# Altium project LPCB221__RLOOP__GIMBAL_NODE.PrjPCB
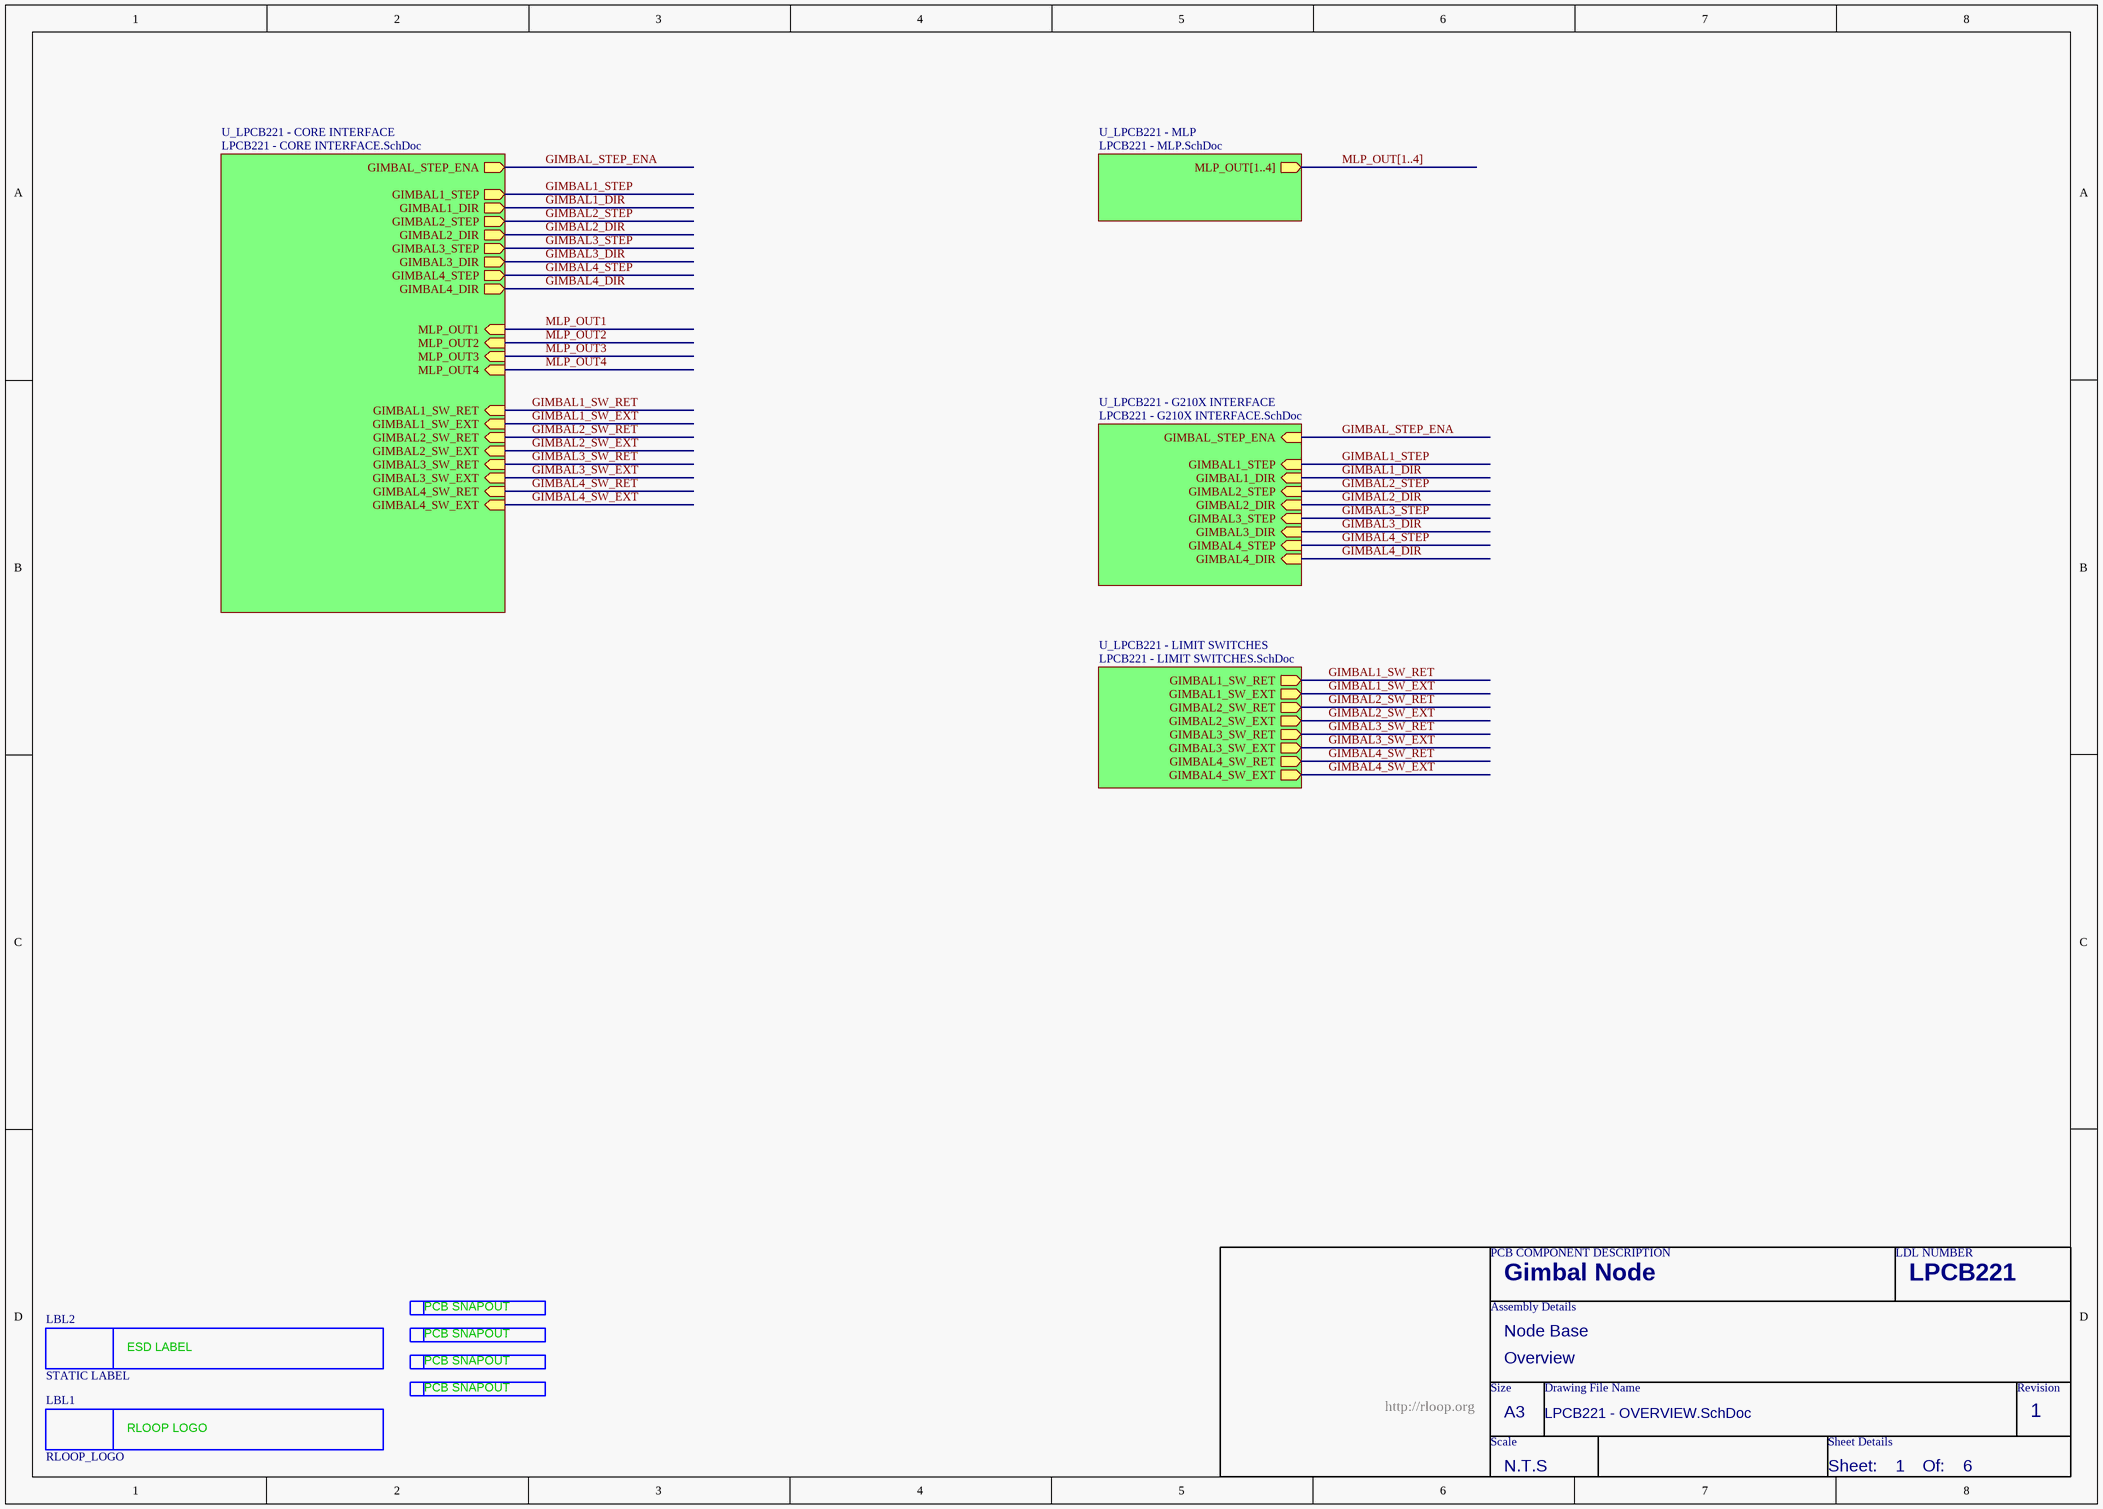
[diagram p0: LPCB221 - OVERVIEW.SchDoc]
6 sheets, 87 parts. Net scope: hierarchical (ports join the sheet entries above them; power ports are global).
Board files: LPCB221R0.PcbDoc, LPCB221R0__ASCII.PcbDoc
Sheets:
  LPCB221 - OVERVIEW.SchDoc
    U_LPCB221 - G210X INTERFACE = LPCB221 - G210X INTERFACE.SchDoc
    U_LPCB221 - MLP = LPCB221 - MLP.SchDoc
      M1 = LPCB221 - MLP CHANNEL.SchDoc
      M2 = LPCB221 - MLP CHANNEL.SchDoc
      M3 = LPCB221 - MLP CHANNEL.SchDoc
      M4 = LPCB221 - MLP CHANNEL.SchDoc
    U_LPCB221 - LIMIT SWITCHES = LPCB221 - LIMIT SWITCHES.SchDoc
    U_LPCB221 - CORE INTERFACE = LPCB221 - CORE INTERFACE.SchDoc

## Sheet LPCB221 - OVERVIEW.SchDoc
size A3; Address1: Factory 10; Address2: 9-13 Dingley Avenue, Dandeong, VICTORIA 3175, AUSTRALIA; DocumentNumber: 1; Revision: 1; SheetNumber: 1; SheetTotal: 6; Lockie__PCB_SUB_ASSEMBLY: Overview; Lockie__PCB_ASSEMBLY: Node Base; Lockie__LDL: LPCB221; Lockie__PCB_DESCRIPTION: Gimbal Node

### Parts
LBL1  RLOOP_LOGO  [RLOOP_LOGO]  (no BOM)
LBL2  STATIC LABEL  [STATIC_LABEL]  (no BOM)
SN1  PCB_SNAPOUT  [SNAPOUT_NEW]  (value not drawn)  (no BOM)
SN2  PCB_SNAPOUT  [SNAPOUT_NEW]  (value not drawn)  (no BOM)
SN3  PCB_SNAPOUT  [SNAPOUT_NEW]  (value not drawn)  (no BOM)
SN4  PCB_SNAPOUT  [SNAPOUT_NEW]  (value not drawn)  (no BOM)

### Sub-sheets
U_LPCB221 - CORE INTERFACE = LPCB221 - CORE INTERFACE.SchDoc: GIMBAL_STEP_ENA (out), GIMBAL2_DIR (out), GIMBAL1_STEP (out), GIMBAL2_STEP (out), GIMBAL1_DIR (out), GIMBAL4_DIR (out), GIMBAL3_STEP (out), GIMBAL4_STEP (out), GIMBAL3_DIR (out), MLP_OUT1 (in), MLP_OUT2 (in), MLP_OUT3 (in), MLP_OUT4 (in), GIMBAL1_SW_RET (in), GIMBAL1_SW_EXT (in), GIMBAL2_SW_RET (in), GIMBAL2_SW_EXT (in), GIMBAL3_SW_RET (in), GIMBAL3_SW_EXT (in), GIMBAL4_SW_RET (in), GIMBAL4_SW_EXT (in)
U_LPCB221 - G210X INTERFACE = LPCB221 - G210X INTERFACE.SchDoc: GIMBAL_STEP_ENA (in), GIMBAL2_DIR (in), GIMBAL1_STEP (in), GIMBAL2_STEP (in), GIMBAL1_DIR (in), GIMBAL4_DIR (in), GIMBAL3_STEP (in), GIMBAL4_STEP (in), GIMBAL3_DIR (in)
U_LPCB221 - LIMIT SWITCHES = LPCB221 - LIMIT SWITCHES.SchDoc: GIMBAL1_SW_RET (out), GIMBAL1_SW_EXT (out), GIMBAL2_SW_RET (out), GIMBAL2_SW_EXT (out), GIMBAL3_SW_RET (out), GIMBAL3_SW_EXT (out), GIMBAL4_SW_RET (out), GIMBAL4_SW_EXT (out)
U_LPCB221 - MLP = LPCB221 - MLP.SchDoc: MLP_OUT[1..4] (out)

### Nets
GIMBAL1_DIR: sheet U_LPCB221 - G210X INTERFACE/GIMBAL1_DIR, sheet U_LPCB221 - CORE INTERFACE/GIMBAL1_DIR
GIMBAL1_STEP: sheet U_LPCB221 - G210X INTERFACE/GIMBAL1_STEP, sheet U_LPCB221 - CORE INTERFACE/GIMBAL1_STEP
GIMBAL1_SW_EXT: sheet U_LPCB221 - LIMIT SWITCHES/GIMBAL1_SW_EXT, sheet U_LPCB221 - CORE INTERFACE/GIMBAL1_SW_EXT
GIMBAL1_SW_RET: sheet U_LPCB221 - LIMIT SWITCHES/GIMBAL1_SW_RET, sheet U_LPCB221 - CORE INTERFACE/GIMBAL1_SW_RET
GIMBAL2_DIR: sheet U_LPCB221 - G210X INTERFACE/GIMBAL2_DIR, sheet U_LPCB221 - CORE INTERFACE/GIMBAL2_DIR
GIMBAL2_STEP: sheet U_LPCB221 - G210X INTERFACE/GIMBAL2_STEP, sheet U_LPCB221 - CORE INTERFACE/GIMBAL2_STEP
GIMBAL2_SW_EXT: sheet U_LPCB221 - LIMIT SWITCHES/GIMBAL2_SW_EXT, sheet U_LPCB221 - CORE INTERFACE/GIMBAL2_SW_EXT
GIMBAL2_SW_RET: sheet U_LPCB221 - LIMIT SWITCHES/GIMBAL2_SW_RET, sheet U_LPCB221 - CORE INTERFACE/GIMBAL2_SW_RET
GIMBAL3_DIR: sheet U_LPCB221 - G210X INTERFACE/GIMBAL3_DIR, sheet U_LPCB221 - CORE INTERFACE/GIMBAL3_DIR
GIMBAL3_STEP: sheet U_LPCB221 - G210X INTERFACE/GIMBAL3_STEP, sheet U_LPCB221 - CORE INTERFACE/GIMBAL3_STEP
GIMBAL3_SW_EXT: sheet U_LPCB221 - LIMIT SWITCHES/GIMBAL3_SW_EXT, sheet U_LPCB221 - CORE INTERFACE/GIMBAL3_SW_EXT
GIMBAL3_SW_RET: sheet U_LPCB221 - LIMIT SWITCHES/GIMBAL3_SW_RET, sheet U_LPCB221 - CORE INTERFACE/GIMBAL3_SW_RET
GIMBAL4_DIR: sheet U_LPCB221 - G210X INTERFACE/GIMBAL4_DIR, sheet U_LPCB221 - CORE INTERFACE/GIMBAL4_DIR
GIMBAL4_STEP: sheet U_LPCB221 - G210X INTERFACE/GIMBAL4_STEP, sheet U_LPCB221 - CORE INTERFACE/GIMBAL4_STEP
GIMBAL4_SW_EXT: sheet U_LPCB221 - LIMIT SWITCHES/GIMBAL4_SW_EXT, sheet U_LPCB221 - CORE INTERFACE/GIMBAL4_SW_EXT
GIMBAL4_SW_RET: sheet U_LPCB221 - LIMIT SWITCHES/GIMBAL4_SW_RET, sheet U_LPCB221 - CORE INTERFACE/GIMBAL4_SW_RET
GIMBAL_STEP_ENA: sheet U_LPCB221 - G210X INTERFACE/GIMBAL_STEP_ENA, sheet U_LPCB221 - CORE INTERFACE/GIMBAL_STEP_ENA

### Buses and harness runs
bus MLP_OUT[1..4] = sheet U_LPCB221 - MLP/MLP_OUT[1..4]

### Notes on the sheet
- PCB COMPONENT DESCRIPTION
- LDL NUMBER
- Assembly Details
- Size
- Drawing File Name
- Revision
- http://rloop.org
- Scale
- A3
- Sheet Details
- N.T.S
- Sheet:
- Of:
- (in symbol PCB_SNAPOUT) PCB SNAPOUT
- (in symbol RLOOP_LOGO) RLOOP LOGO
- (in symbol STATIC LABEL) ESD LABEL

### Library data of the parts
LBL1 = RLOOP_LOGO: FMEDA__CHANNEL: DIAG; FMEDA__FUNCTION_IN_SYSTEM: *
LBL2 = STATIC LABEL: FMEDA__CHANNEL: DIAG; FMEDA__FUNCTION_IN_SYSTEM: *
SN1-SN4 = PCB_SNAPOUT: FMEDA__CHANNEL: DIAG; FMEDA__FUNCTION_IN_SYSTEM: *

## Sheet LPCB221 - G210X INTERFACE.SchDoc
size A3; Address1: Factory 10; Address2: 9-13 Dingley Avenue, Dandeong, VICTORIA 3175, AUSTRALIA; DocumentNumber: 3; Revision: 1; SheetNumber: 3; SheetTotal: 6; Lockie__PCB_SUB_ASSEMBLY: G210X Interface; Lockie__PCB_ASSEMBLY: Node Base; Lockie__LDL: LPCB221; Lockie__PCB_DESCRIPTION: Gimbal Node
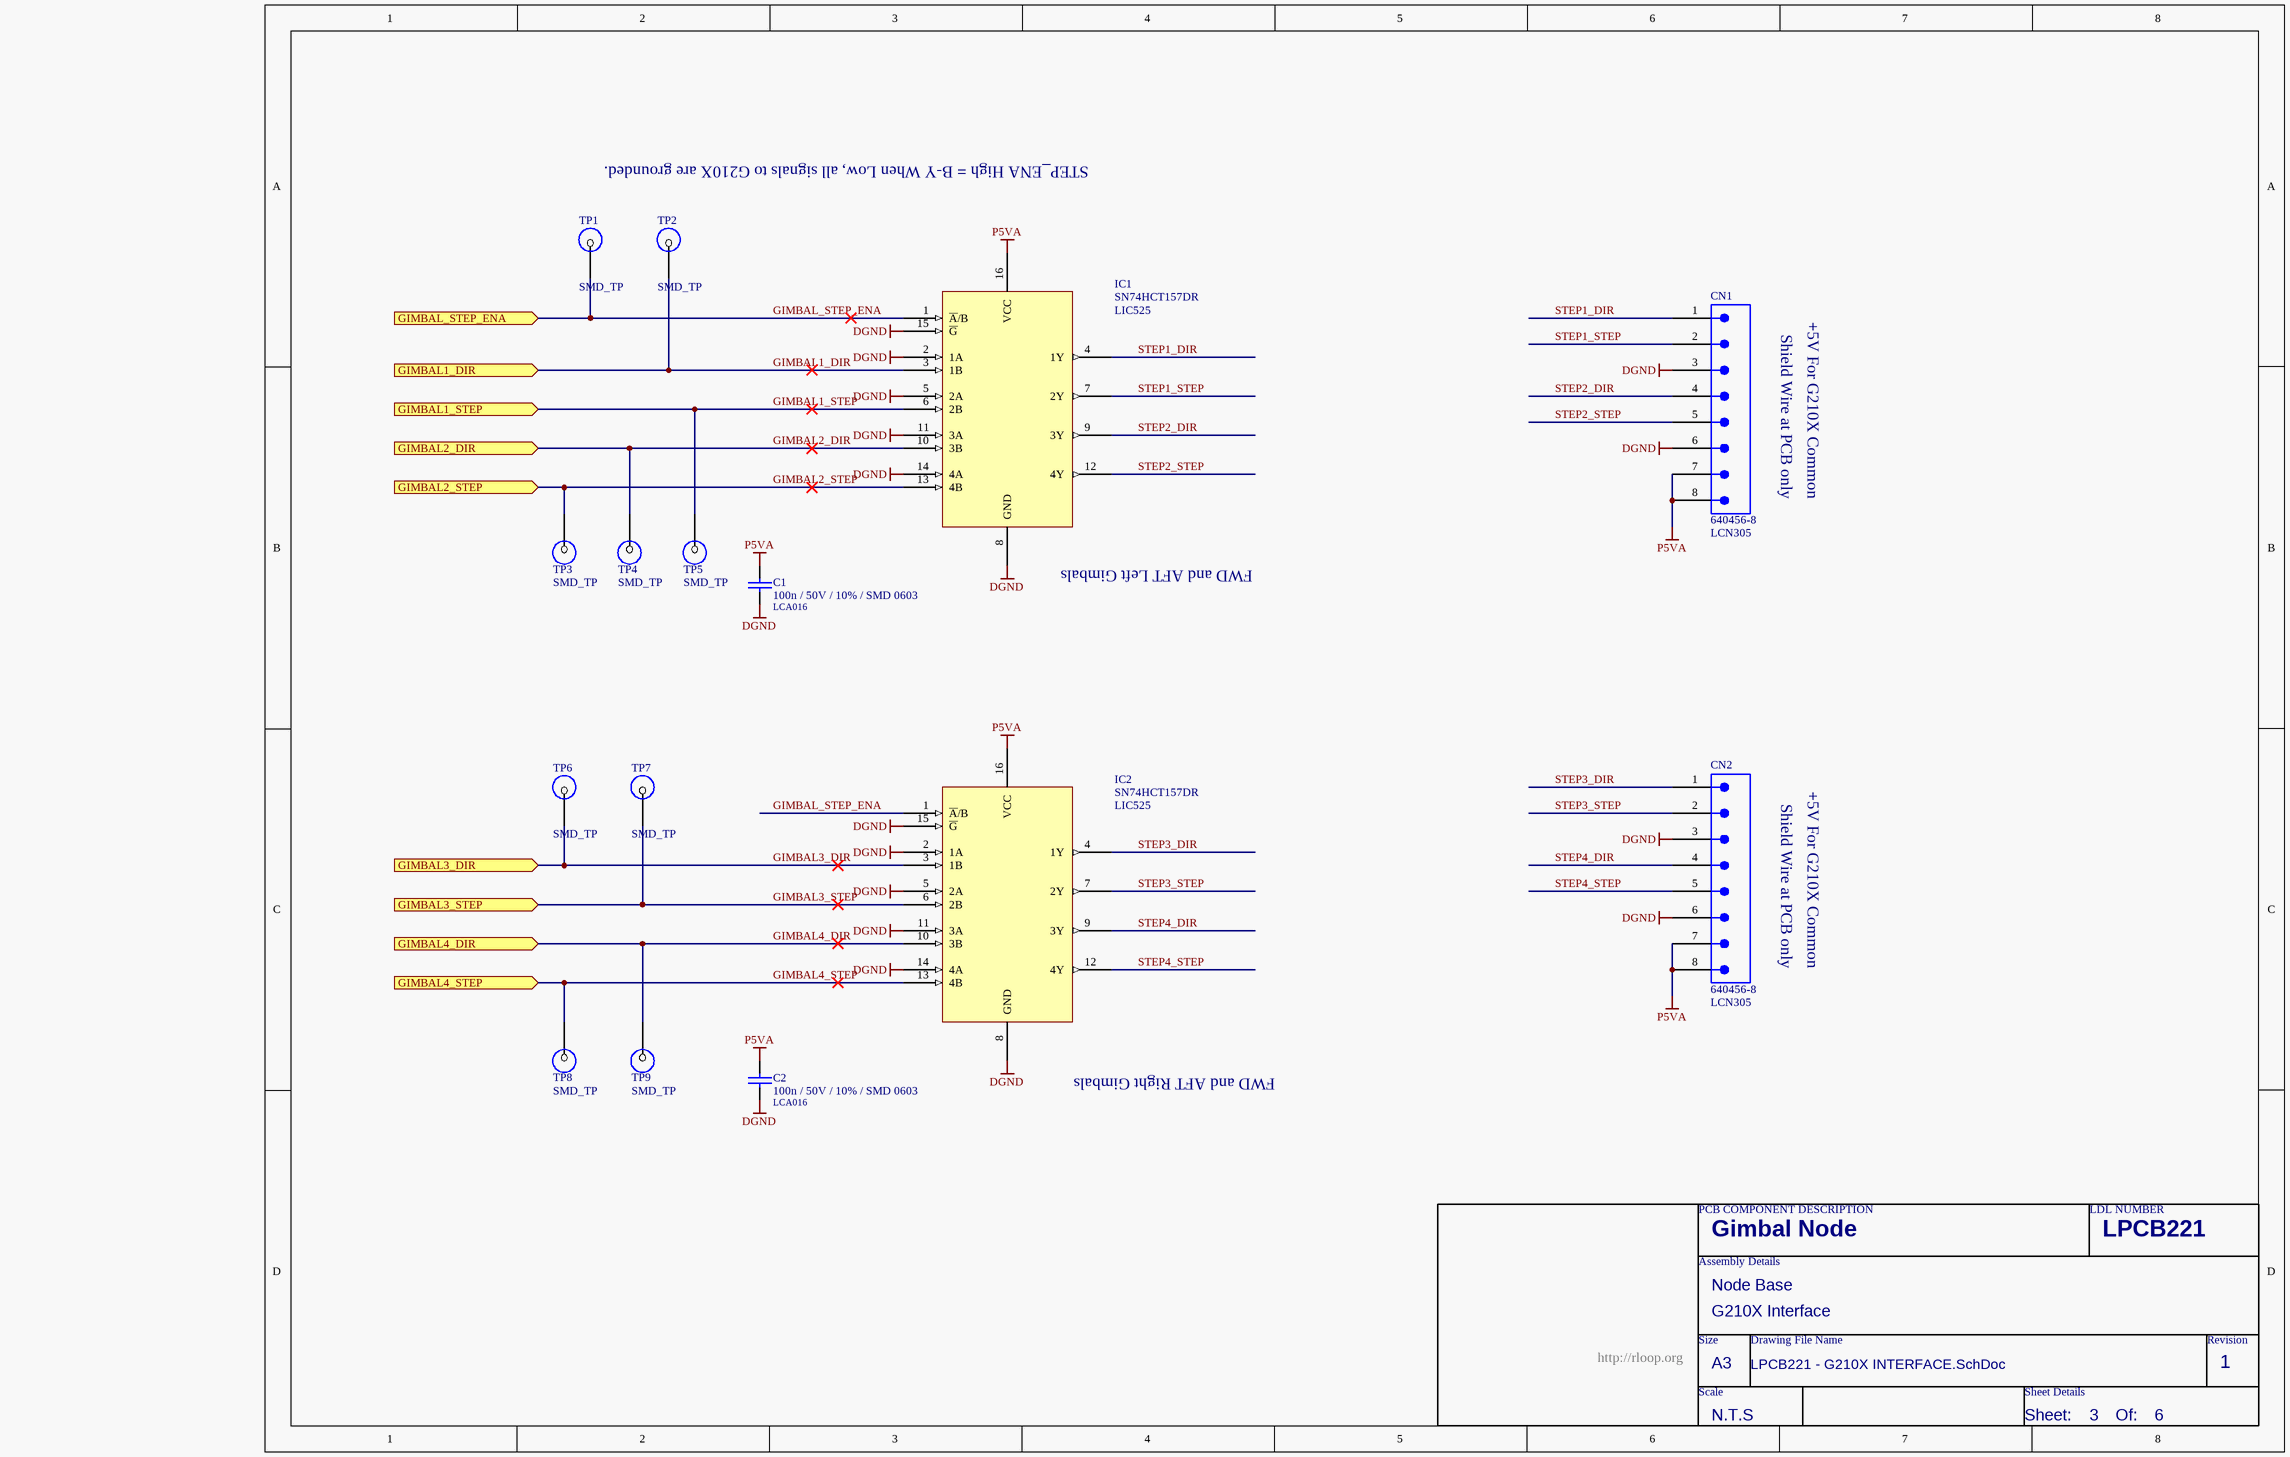
[diagram p1: LPCB221 - G210X INTERFACE.SchDoc]

### Parts
C1  100n / 50V / 10% / SMD 0603  LDL_NUMBER: LCA016  [LFP011__CC1608-0603-IPC7351_B]
C2  100n / 50V / 10% / SMD 0603  LDL_NUMBER: LCA016  [LFP011__CC1608-0603-IPC7351_B]
CN1  640456-8  LDL_NUMBER: LCN305  [640456-8]
CN2  640456-8  LDL_NUMBER: LCN305  [640456-8]
IC1  SN74HCT157DR  LDL_NUMBER: LIC525  [LFP079__SOP16]
IC2  SN74HCT157DR  LDL_NUMBER: LIC525  [LFP079__SOP16]
TP1  SMD_TP  [SMD-TP]  (no BOM)
TP2  SMD_TP  [SMD-TP]  (no BOM)
TP3  SMD_TP  [SMD-TP]  (no BOM)
TP4  SMD_TP  [SMD-TP]  (no BOM)
TP5  SMD_TP  [SMD-TP]  (no BOM)
TP6  SMD_TP  [SMD-TP]  (no BOM)
TP7  SMD_TP  [SMD-TP]  (no BOM)
TP8  SMD_TP  [SMD-TP]  (no BOM)
TP9  SMD_TP  [SMD-TP]  (no BOM)

### Ports
GIMBAL1_DIR (in), GIMBAL1_STEP (in), GIMBAL2_DIR (in), GIMBAL2_STEP (in), GIMBAL3_DIR (in), GIMBAL3_STEP (in), GIMBAL4_DIR (in), GIMBAL4_STEP (in), GIMBAL_STEP_ENA (in)

### Nets
DGND: C1.2 C2.2 CN1.3 CN1.6 CN2.3 CN2.6 IC1.2(1A) IC1.5(2A) IC1.8(GND) IC1.11(3A) IC1.14(4A) IC1.15(~{G}) IC2.2(1A) IC2.5(2A) IC2.8(GND) IC2.11(3A) IC2.14(4A) IC2.15(~{G})
P5VA: C1.1 C2.1 CN1.7 CN1.8 CN2.7 CN2.8 IC1.16(VCC) IC2.16(VCC)
GIMBAL1_DIR: IC1.3(1B) TP2.1 ; port GIMBAL1_DIR
GIMBAL1_STEP: IC1.6(2B) TP5.1 ; port GIMBAL1_STEP
GIMBAL2_DIR: IC1.10(3B) TP4.1 ; port GIMBAL2_DIR
GIMBAL2_STEP: IC1.13(4B) TP3.1 ; port GIMBAL2_STEP
GIMBAL3_DIR: IC2.3(1B) TP6.1 ; port GIMBAL3_DIR
GIMBAL3_STEP: IC2.6(2B) TP7.1 ; port GIMBAL3_STEP
GIMBAL4_DIR: IC2.10(3B) TP9.1 ; port GIMBAL4_DIR
GIMBAL4_STEP: IC2.13(4B) TP8.1 ; port GIMBAL4_STEP
GIMBAL_STEP_ENA: IC1.1(~{A}/B) IC2.1(~{A}/B) TP1.1 ; port GIMBAL_STEP_ENA
STEP1_DIR: CN1.1 IC1.4(1Y)
STEP1_STEP: CN1.2 IC1.7(2Y)
STEP2_DIR: CN1.4 IC1.9(3Y)
STEP2_STEP: CN1.5 IC1.12(4Y)
STEP3_DIR: CN2.1 IC2.4(1Y)
STEP3_STEP: CN2.2 IC2.7(2Y)
STEP4_DIR: CN2.4 IC2.9(3Y)
STEP4_STEP: CN2.5 IC2.12(4Y)

### Notes on the sheet
- STEP_ENA High = B-Y When Low, all signals to G210X are grounded.
- Shield Wire at PCB only
- +5V For G210X Common
- (near IC1) FWD and AFT Left Gimbals
- FWD and AFT Right Gimbals
- PCB COMPONENT DESCRIPTION
- LDL NUMBER
- Assembly Details
- Size
- Drawing File Name
- Revision
- http://rloop.org
- Scale
- A3
- Sheet Details
- N.T.S
- Sheet:
- Of:

### Library data of the parts
C1 C2 = 100n / 50V / 10% / SMD 0603: Capacitor, Ceramic Chip, 100nF (0.1uF), 50V, 5%, SMD 0603 [LCA016]; FMEDA__OPERATING__VOLTAGE_MIN: 0; FMEDA__OPERATING__VOLTAGE_MAX: 3.3; FMEDA__OPERATING__TEMP_MIN: -20; FMEDA__OPERATING__TEMP_TYP: 27; FMEDA__OPERATING__TEMP_MAX: 50; FMEDA__CHANNEL: COM; Value: 100n; FMEDA__FUNCTION_IN_SYSTEM: *; FMEDA__OPERATING__VOLTAGE_TYP: 3.3
CN1 CN2 = 640456-8: Connector, Male Header, 8 Way; FMEDA__CHANNEL: COM; FMEDA__OPERATING__CURRENT_MAX: 0; FMEDA__OPERATING__TEMP_MAX: 50; FMEDA__OPERATING__TEMP_MIN: -20; FMEDA__OPERATING__TEMP_TYP: 27; FMEDA__OPERATING__VOLTAGE_MAX: 16; FMEDA__OPERATING__VOLTAGE_TYP: 12; FMEDA__FUNCTION_IN_SYSTEM: *; FMEDA__OPERATING__CURRENT_MIN: 0; FMEDA__OPERATING__CURRENT_TYP: 0; FMEDA__OPERATING__VOLTAGE_MIN: 0
IC1 IC2 = SN74HCT157DR: IC, Multiplexer Select 2-1 [LIC525]; FMEDA__CHANNEL: COM; FMEDA__FUNCTION_IN_SYSTEM: *
TP1-TP9 = SMD_TP: SMD Test Point; FMEDA__CHANNEL: COM; FMEDA__OPERATING__CURRENT_MAX: 0; FMEDA__OPERATING__TEMP_MAX: 50; FMEDA__OPERATING__TEMP_MIN: -20; FMEDA__OPERATING__TEMP_TYP: 27; FMEDA__OPERATING__VOLTAGE_MAX: 16; FMEDA__OPERATING__VOLTAGE_TYP: 12; FMEDA__OPERATING__CURRENT_MIN: 0; FMEDA__OPERATING__CURRENT_TYP: 0; FMEDA__OPERATING__VOLTAGE_MIN: 0

## Sheet LPCB221 - MLP.SchDoc
size A3; Address1: Factory 10; Address2: 9-13 Dingley Avenue, Dandeong, VICTORIA 3175, AUSTRALIA; DocumentNumber: 5; Revision: 1; SheetNumber: 5; SheetTotal: 6; Lockie__PCB_SUB_ASSEMBLY: MLP Interface; Lockie__PCB_ASSEMBLY: Node Base; Lockie__LDL: LPCB221; Lockie__PCB_DESCRIPTION: Gimbal Node
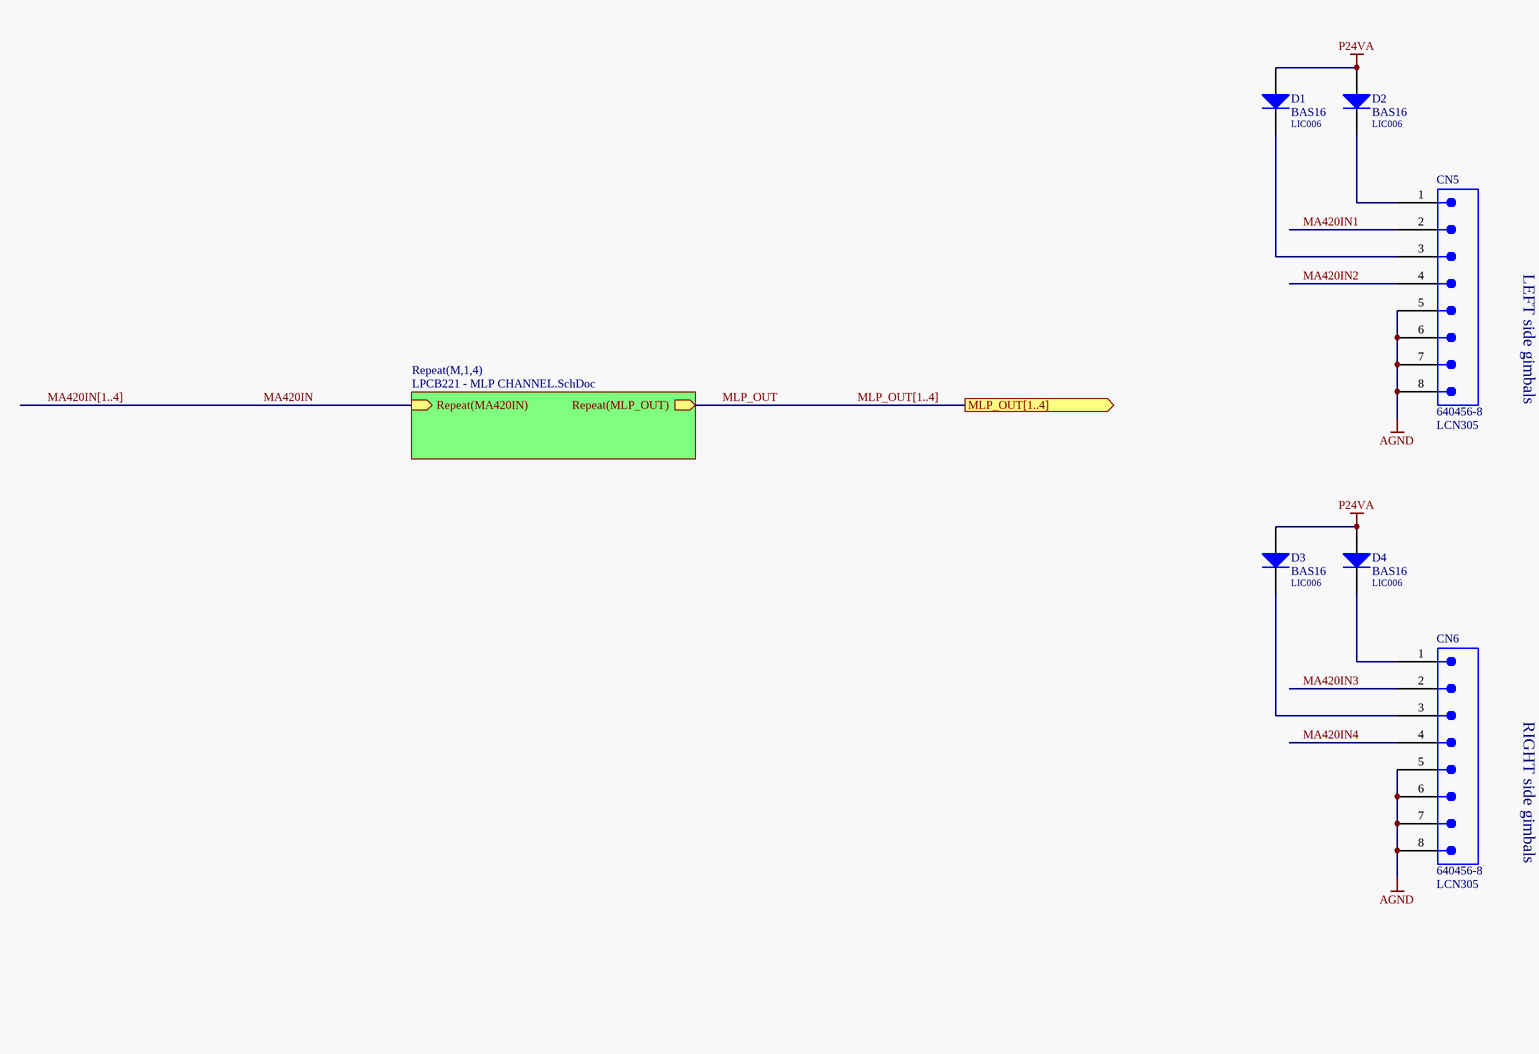
[diagram p2: LPCB221 - MLP.SchDoc]

### Parts
CN5  640456-8  LDL_NUMBER: LCN305  [640456-8]
CN6  640456-8  LDL_NUMBER: LCN305  [640456-8]
D1  BAS16  LDL_NUMBER: LIC006  [LFP021__SOT23]
D2  BAS16  LDL_NUMBER: LIC006  [LFP021__SOT23]
D3  BAS16  LDL_NUMBER: LIC006  [LFP021__SOT23]
D4  BAS16  LDL_NUMBER: LIC006  [LFP021__SOT23]

### Sub-sheets
Repeat(M,1,4) = LPCB221 - MLP CHANNEL.SchDoc: Repeat(MA420IN) (in), Repeat(MLP_OUT) (out)

### Ports
MLP_OUT[1..4] (out)

### Nets
AGND: CN5.5 CN5.6 CN5.7 CN5.8 CN6.5 CN6.6 CN6.7 CN6.8
P24VA: D1.1(A) D2.1(A) D3.1(A) D4.1(A)
MA420IN: sheet Repeat(M,1,4)/Repeat(MA420IN)
MA420IN1: CN5.2
MA420IN2: CN5.4
MA420IN3: CN6.2
MA420IN4: CN6.4
MLP_OUT: sheet Repeat(M,1,4)/Repeat(MLP_OUT)
NetCN5_1: CN5.1 D2.3(K)
NetCN5_3: CN5.3 D1.3(K)
NetCN6_1: CN6.1 D4.3(K)
NetCN6_3: CN6.3 D3.3(K)

### Buses and harness runs
bus MA420IN[1..4]
bus MLP_OUT[1..4] = port MLP_OUT[1..4]

### Notes on the sheet
- LEFT side gimbals
- RIGHT side gimbals
- PCB COMPONENT DESCRIPTION
- LDL NUMBER
- Assembly Details
- Size
- Drawing File Name
- Revision
- http://rloop.org
- Scale
- A3
- Sheet Details
- N.T.S
- Sheet:
- Of:

### Library data of the parts
CN5 CN6 = 640456-8: as CN1 on sheet LPCB221 - G210X INTERFACE; FMEDA__FUNCTION_IN_SYSTEM: *; FMEDA__OPERATING__CURRENT_MIN: 0; FMEDA__OPERATING__CURRENT_TYP: 0; FMEDA__OPERATING__VOLTAGE_MIN: 0
D1-D4 = BAS16: Diode, Small Signal, 0.2A, 85V, SMD SOT-23 [LIC006]; FMEDA__OPERATING__CURRENT_MIN: 0; FMEDA__OPERATING__TEMP_MIN: -20; FMEDA__OPERATING__TEMP_TYP: 27; FMEDA__OPERATING__TEMP_MAX: 50; FMEDA__CHANNEL: COM; FMEDA__OPERATING__CURRENT_MAX: 0; FMEDA__OPERATING__VOLTAGE_MIN: 0; FMEDA__OPERATING__VOLTAGE_MAX: 0; FMEDA__FUNCTION_IN_SYSTEM: *; FMEDA__OPERATING__CURRENT_TYP: 0; FMEDA__OPERATING__VOLTAGE_TYP: 0

## Sheet LPCB221 - MLP CHANNEL.SchDoc
size A3; Address1: Factory 10; Address2: 9-13 Dingley Avenue, Dandeong, VICTORIA 3175, AUSTRALIA; DocumentNumber: 6; Revision: 1; SheetNumber: 6; SheetTotal: 6; Lockie__PCB_SUB_ASSEMBLY: MLP Multichannel; Lockie__PCB_ASSEMBLY: Node Base; Lockie__LDL: LPCB221; Lockie__PCB_DESCRIPTION: Gimbal Node
Used 4 times, as channels U_LPCB221 - MLP/M1, U_LPCB221 - MLP/M2, U_LPCB221 - MLP/M3, U_LPCB221 - MLP/M4. Parts and nets are listed once, with the designators drawn on the sheet.
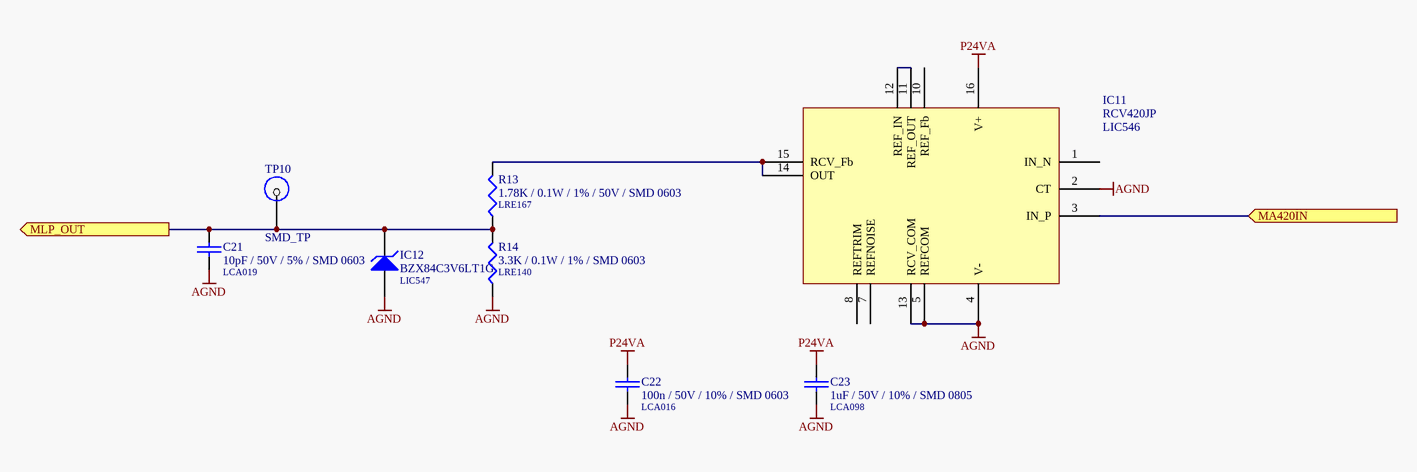
[diagram p3: LPCB221 - MLP CHANNEL.SchDoc]

### Parts
C21  10pF / 50V / 5% / SMD 0603  LDL_NUMBER: LCA019  [LFP011__CC1608-0603-IPC7351_B]
C22  100n / 50V / 10% / SMD 0603  LDL_NUMBER: LCA016  [LFP011__CC1608-0603-IPC7351_B]
C23  1uF / 50V / 10% / SMD 0805  LDL_NUMBER: LCA098  [LFP010__CC2012-0805-IPC7351_B]
IC11  RCV420JP  LDL_NUMBER: LIC546  [DIP-P16/X1.5]
IC12  BZX84C3V6LT1G  LDL_NUMBER: LIC547  [LFP021__SOT23]
R13  1.78K / 0.1W / 1% / 50V / SMD 0603  LDL_NUMBER: LRE167  [LFP020__CR1608-0603-IPC7351_B]
R14  3.3K / 0.1W / 1% / SMD 0603  LDL_NUMBER: LRE140  [LFP020__CR1608-0603-IPC7351_B]
TP10  SMD_TP  [SMD-TP]  (no BOM)

### Ports
MA420IN (in), MLP_OUT (out)

### Nets
AGND: C21.2 C22.2 C23.2 IC11.2(CT) IC11.4(V-) IC11.5(REFCOM) IC11.13(RCV_COM) IC12.1(A) R14.1
P24VA: C22.1 C23.1 IC11.16(V+)
MA420IN: IC11.3(IN_P) ; port MA420IN
MLP_OUT: C21.1 IC12.3(K) R13.1 R14.2 TP10.1 ; port MLP_OUT
NetIC11_11: IC11.11(REF_OUT) IC11.12(REF_IN)
NetIC11_14: IC11.14(OUT) IC11.15(RCV_Fb) R13.2

Not connected (* = marked no-connect by the designer): IC11 1(IN_N) 7(REFNOISE) 8(REFTRIM) 10(REF_Fb)

### Channels
U_LPCB221 - MLP/M1: designators end in _M1; ports MA420IN=MA420IN1 MLP_OUT=MLP_OUT1
U_LPCB221 - MLP/M2: designators end in _M2; ports MA420IN=MA420IN2 MLP_OUT=MLP_OUT2
U_LPCB221 - MLP/M3: designators end in _M3; ports MA420IN=MA420IN3 MLP_OUT=MLP_OUT3
U_LPCB221 - MLP/M4: designators end in _M4; ports MA420IN=MA420IN4 MLP_OUT=MLP_OUT4

### Notes on the sheet
- PCB COMPONENT DESCRIPTION
- LDL NUMBER
- Assembly Details
- Size
- Drawing File Name
- Revision
- http://rloop.org
- Scale
- A3
- Sheet Details
- N.T.S
- Sheet:
- Of:

### Library data of the parts
C21 = 10pF / 50V / 5% / SMD 0603: Capacitor, Ceramic Chip, 10pF, 50V, 5%, SMD 0603 [LCA019]; Value: 10p; FMEDA__OPERATING__VOLTAGE_MAX: 3.3; FMEDA__OPERATING__VOLTAGE_MIN: 0; FMEDA__OPERATING__TEMP_MAX: 50; FMEDA__OPERATING__TEMP_MIN: -20; FMEDA__OPERATING__TEMP_TYP: 27; FMEDA__CHANNEL: COM; FMEDA__OPERATING__VOLTAGE_TYP: 3.3; FMEDA__FUNCTION_IN_SYSTEM: *
C22 = 100n / 50V / 10% / SMD 0603: as C1 on sheet LPCB221 - G210X INTERFACE; Value: 100n; FMEDA__FUNCTION_IN_SYSTEM: *; FMEDA__OPERATING__VOLTAGE_TYP: 3.3
C23 = 1uF / 50V / 10% / SMD 0805: Capacitor, Ceramic Chip, 1uF, 50V, SMD 0805 [LCA098]; Value: 1u; FMEDA__OPERATING__VOLTAGE_MAX: 3.3; FMEDA__OPERATING__VOLTAGE_MIN: 0; FMEDA__OPERATING__TEMP_MAX: 50; FMEDA__OPERATING__TEMP_MIN: -20; FMEDA__OPERATING__TEMP_TYP: 27; FMEDA__CHANNEL: COM; FMEDA__OPERATING__VOLTAGE_TYP: 3.3; FMEDA__FUNCTION_IN_SYSTEM: *
IC11 = RCV420JP: IC, 4-20mA Interface, DIP16 [LIC546]
IC12 = BZX84C3V6LT1G: Diode, Zener, 3.6V, 0.225W, SMD [LIC083]; FMEDA__OPERATING__TEMP_MAX: 50; FMEDA__OPERATING__TEMP_MIN: -20; FMEDA__OPERATING__TEMP_TYP: 27; FMEDA__OPERATING__VOLTAGE_MAX: 0; FMEDA__CHANNEL: COM; Revision: 17-Jul-2002: Re-released for DXP Platform.; FMEDA__FUNCTION_IN_SYSTEM: *; FMEDA__OPERATING__VOLTAGE_MIN: 0; FMEDA__OPERATING__VOLTAGE_TYP: 0; FMEDA__OPERATING__CURRENT_MAX: 0; FMEDA__OPERATING__CURRENT_MIN: 0; FMEDA__OPERATING__CURRENT_TYP: 0
R13 = 1.78K / 0.1W / 1% / 50V / SMD 0603: Resistor, Ceramic Chip, 1.78K, 0.1W, 1%, SMD 0603 [LRE167]; FMEDA__OPERATING__POWER_MAX: 0.01; FMEDA__OPERATING__POWER_MIN: 0; FMEDA__OPERATING__TEMP_MAX: 50; FMEDA__OPERATING__TEMP_MIN: -20; FMEDA__OPERATING__TEMP_TYP: 27; FMEDA__CHANNEL: COM; Value: 1.78K; FMEDA__OPERATING__VOLTAGE_MAX: 0; FMEDA__OPERATING__VOLTAGE_MIN: 0; FMEDA__OPERATING__VOLTAGE_TYP: 0; FMEDA__FUNCTION_IN_SYSTEM: *
R14 = 3.3K / 0.1W / 1% / SMD 0603: Resistor, Ceramic Chip, 3.3K0, 0.1W, 1%, SMD 0603 [LRE140]; FMEDA__OPERATING__POWER_MAX: 0; FMEDA__OPERATING__TEMP_MAX: 50; FMEDA__OPERATING__TEMP_MIN: -20; FMEDA__OPERATING__TEMP_TYP: 27; FMEDA__CHANNEL: COM; Value: 3.3K; FMEDA__OPERATING__POWER_MIN: 0; FMEDA__OPERATING__VOLTAGE_MAX: 0; FMEDA__OPERATING__VOLTAGE_MIN: 0; FMEDA__OPERATING__VOLTAGE_TYP: 0; FMEDA__FUNCTION_IN_SYSTEM: *
TP10 = SMD_TP: as TP1 on sheet LPCB221 - G210X INTERFACE; FMEDA__OPERATING__CURRENT_MIN: 0; FMEDA__OPERATING__CURRENT_TYP: 0; FMEDA__OPERATING__VOLTAGE_MIN: 0

## Sheet LPCB221 - LIMIT SWITCHES.SchDoc
size A3; Address1: Factory 10; Address2: 9-13 Dingley Avenue, Dandeong, VICTORIA 3175, AUSTRALIA; DocumentNumber: 4; Revision: 1; SheetNumber: 4; SheetTotal: 6; Lockie__PCB_SUB_ASSEMBLY: Limit Switches; Lockie__PCB_ASSEMBLY: Node Base; Lockie__LDL: LPCB221; Lockie__PCB_DESCRIPTION: Gimbal Node
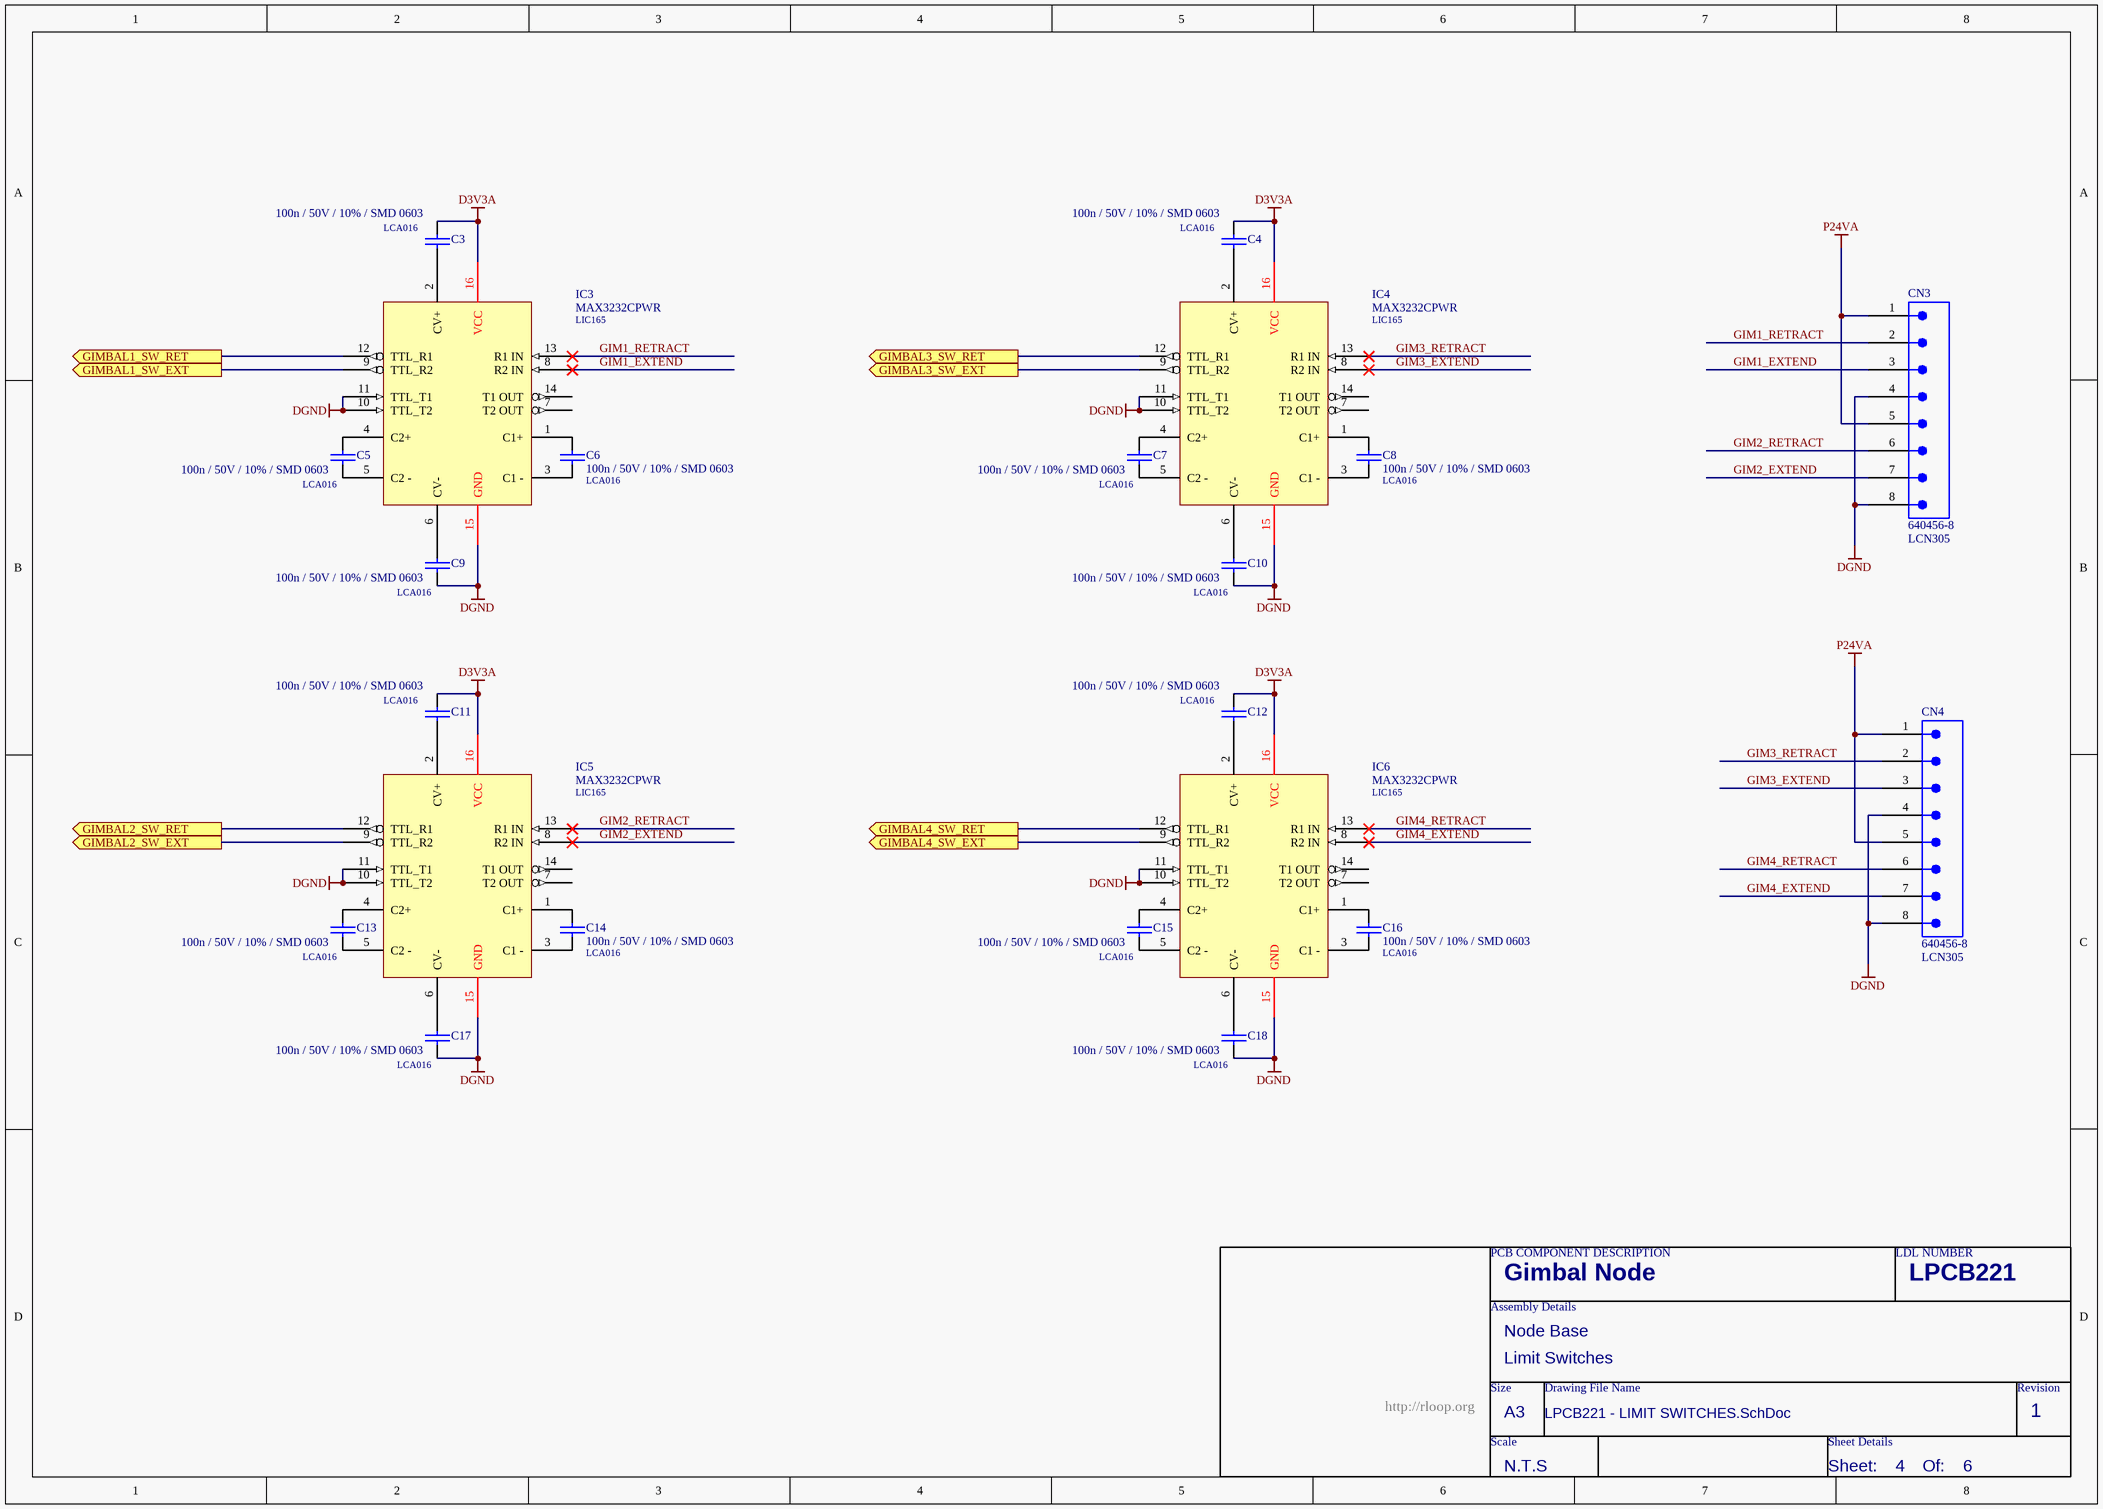
[diagram p4: LPCB221 - LIMIT SWITCHES.SchDoc]

### Parts
C3  100n / 50V / 10% / SMD 0603  LDL_NUMBER: LCA016  [LFP011__CC1608-0603-IPC7351_B]
C4  100n / 50V / 10% / SMD 0603  LDL_NUMBER: LCA016  [LFP011__CC1608-0603-IPC7351_B]
C5  100n / 50V / 10% / SMD 0603  LDL_NUMBER: LCA016  [LFP011__CC1608-0603-IPC7351_B]
C6  100n / 50V / 10% / SMD 0603  LDL_NUMBER: LCA016  [LFP011__CC1608-0603-IPC7351_B]
C7  100n / 50V / 10% / SMD 0603  LDL_NUMBER: LCA016  [LFP011__CC1608-0603-IPC7351_B]
C8  100n / 50V / 10% / SMD 0603  LDL_NUMBER: LCA016  [LFP011__CC1608-0603-IPC7351_B]
C9  100n / 50V / 10% / SMD 0603  LDL_NUMBER: LCA016  [LFP011__CC1608-0603-IPC7351_B]
C10  100n / 50V / 10% / SMD 0603  LDL_NUMBER: LCA016  [LFP011__CC1608-0603-IPC7351_B]
C11  100n / 50V / 10% / SMD 0603  LDL_NUMBER: LCA016  [LFP011__CC1608-0603-IPC7351_B]
C12  100n / 50V / 10% / SMD 0603  LDL_NUMBER: LCA016  [LFP011__CC1608-0603-IPC7351_B]
C13  100n / 50V / 10% / SMD 0603  LDL_NUMBER: LCA016  [LFP011__CC1608-0603-IPC7351_B]
C14  100n / 50V / 10% / SMD 0603  LDL_NUMBER: LCA016  [LFP011__CC1608-0603-IPC7351_B]
C15  100n / 50V / 10% / SMD 0603  LDL_NUMBER: LCA016  [LFP011__CC1608-0603-IPC7351_B]
C16  100n / 50V / 10% / SMD 0603  LDL_NUMBER: LCA016  [LFP011__CC1608-0603-IPC7351_B]
C17  100n / 50V / 10% / SMD 0603  LDL_NUMBER: LCA016  [LFP011__CC1608-0603-IPC7351_B]
C18  100n / 50V / 10% / SMD 0603  LDL_NUMBER: LCA016  [LFP011__CC1608-0603-IPC7351_B]
CN3  640456-8  LDL_NUMBER: LCN305  [640456-8]
CN4  640456-8  LDL_NUMBER: LCN305  [640456-8]
IC3  MAX3232CPWR  LDL_NUMBER: LIC165  [LFP049__TSSOP-16]
IC4  MAX3232CPWR  LDL_NUMBER: LIC165  [LFP049__TSSOP-16]
IC5  MAX3232CPWR  LDL_NUMBER: LIC165  [LFP049__TSSOP-16]
IC6  MAX3232CPWR  LDL_NUMBER: LIC165  [LFP049__TSSOP-16]

### Ports
GIMBAL1_SW_EXT (out), GIMBAL1_SW_RET (out), GIMBAL2_SW_EXT (out), GIMBAL2_SW_RET (out), GIMBAL3_SW_EXT (out), GIMBAL3_SW_RET (out), GIMBAL4_SW_EXT (out), GIMBAL4_SW_RET (out)

### Nets
D3V3A: C3.1 C4.1 C11.1 C12.1 IC3.16(VCC) IC4.16(VCC) IC5.16(VCC) IC6.16(VCC)
DGND: C9.2 C10.2 C17.2 C18.2 CN3.4 CN3.8 CN4.4 CN4.8 IC3.10(TTL_T2) IC3.11(TTL_T1) IC3.15(GND) IC4.10(TTL_T2) IC4.11(TTL_T1) IC4.15(GND) IC5.10(TTL_T2) IC5.11(TTL_T1) IC5.15(GND) IC6.10(TTL_T2) IC6.11(TTL_T1) IC6.15(GND)
P24VA: CN3.1 CN3.5 CN4.1 CN4.5
GIM1_EXTEND: CN3.3 IC3.8(R2_IN)
GIM1_RETRACT: CN3.2 IC3.13(R1_IN)
GIM2_EXTEND: CN3.7 IC5.8(R2_IN)
GIM2_RETRACT: CN3.6 IC5.13(R1_IN)
GIM3_EXTEND: CN4.3 IC4.8(R2_IN)
GIM3_RETRACT: CN4.2 IC4.13(R1_IN)
GIM4_EXTEND: CN4.7 IC6.8(R2_IN)
GIM4_RETRACT: CN4.6 IC6.13(R1_IN)
GIMBAL1_SW_EXT: IC3.9(TTL_R2) ; port GIMBAL1_SW_EXT
GIMBAL1_SW_RET: IC3.12(TTL_R1) ; port GIMBAL1_SW_RET
GIMBAL2_SW_EXT: IC5.9(TTL_R2) ; port GIMBAL2_SW_EXT
GIMBAL2_SW_RET: IC5.12(TTL_R1) ; port GIMBAL2_SW_RET
GIMBAL3_SW_EXT: IC4.9(TTL_R2) ; port GIMBAL3_SW_EXT
GIMBAL3_SW_RET: IC4.12(TTL_R1) ; port GIMBAL3_SW_RET
GIMBAL4_SW_EXT: IC6.9(TTL_R2) ; port GIMBAL4_SW_EXT
GIMBAL4_SW_RET: IC6.12(TTL_R1) ; port GIMBAL4_SW_RET
NetC3_2: C3.2 IC3.2(CV+)
NetC4_2: C4.2 IC4.2(CV+)
NetC5_1: C5.1 IC3.4(C2+)
NetC5_2: C5.2 IC3.5(C2_-)
NetC6_1: C6.1 IC3.1(C1+)
NetC6_2: C6.2 IC3.3(C1_-)
NetC7_1: C7.1 IC4.4(C2+)
NetC7_2: C7.2 IC4.5(C2_-)
NetC8_1: C8.1 IC4.1(C1+)
NetC8_2: C8.2 IC4.3(C1_-)
NetC9_1: C9.1 IC3.6(CV-)
NetC10_1: C10.1 IC4.6(CV-)
NetC11_2: C11.2 IC5.2(CV+)
NetC12_2: C12.2 IC6.2(CV+)
NetC13_1: C13.1 IC5.4(C2+)
NetC13_2: C13.2 IC5.5(C2_-)
NetC14_1: C14.1 IC5.1(C1+)
NetC14_2: C14.2 IC5.3(C1_-)
NetC15_1: C15.1 IC6.4(C2+)
NetC15_2: C15.2 IC6.5(C2_-)
NetC16_1: C16.1 IC6.1(C1+)
NetC16_2: C16.2 IC6.3(C1_-)
NetC17_1: C17.1 IC5.6(CV-)
NetC18_1: C18.1 IC6.6(CV-)

Not connected (* = marked no-connect by the designer): IC3 7(T2_OUT) 14(T1_OUT); IC4 7(T2_OUT) 14(T1_OUT); IC5 7(T2_OUT) 14(T1_OUT); IC6 7(T2_OUT) 14(T1_OUT)

### Notes on the sheet
- PCB COMPONENT DESCRIPTION
- LDL NUMBER
- Assembly Details
- Size
- Drawing File Name
- Revision
- http://rloop.org
- Scale
- A3
- Sheet Details
- N.T.S
- Sheet:
- Of:

### Library data of the parts
C3-C18 = 100n / 50V / 10% / SMD 0603: as C1 on sheet LPCB221 - G210X INTERFACE; Value: 100n; FMEDA__FUNCTION_IN_SYSTEM: *; FMEDA__OPERATING__VOLTAGE_TYP: 3.3
CN3 CN4 = 640456-8: as CN1 on sheet LPCB221 - G210X INTERFACE; FMEDA__FUNCTION_IN_SYSTEM: *; FMEDA__OPERATING__CURRENT_MIN: 0; FMEDA__OPERATING__CURRENT_TYP: 0; FMEDA__OPERATING__VOLTAGE_MIN: 0
IC3-IC6 = MAX3232CPWR: IC, RS232 Line Driver, 3.3V, SMD TSSOP16 [LIC165]; FMEDA__OPERATING__TEMP_MAX: 50; FMEDA__OPERATING__TEMP_MIN: -20; FMEDA__OPERATING__TEMP_TYP: 27; FMEDA__CHANNEL: COM; FMEDA__OPERATING__VOLTAGE_MAX: 3.3; FMEDA__OPERATING__VOLTAGE_MIN: 0; FMEDA__FUNCTION_IN_SYSTEM: *; FMEDA__OPERATING__VOLTAGE_TYP: 3.3

## Sheet LPCB221 - CORE INTERFACE.SchDoc
size A3; Address1: Factory 10; Address2: 9-13 Dingley Avenue, Dandeong, VICTORIA 3175, AUSTRALIA; DocumentNumber: 2; Revision: 1; SheetNumber: 2; SheetTotal: 6; Lockie__PCB_SUB_ASSEMBLY: Core Interface; Lockie__PCB_ASSEMBLY: Node Base; Lockie__LDL: LPCB221; Lockie__PCB_DESCRIPTION: Gimbal Node
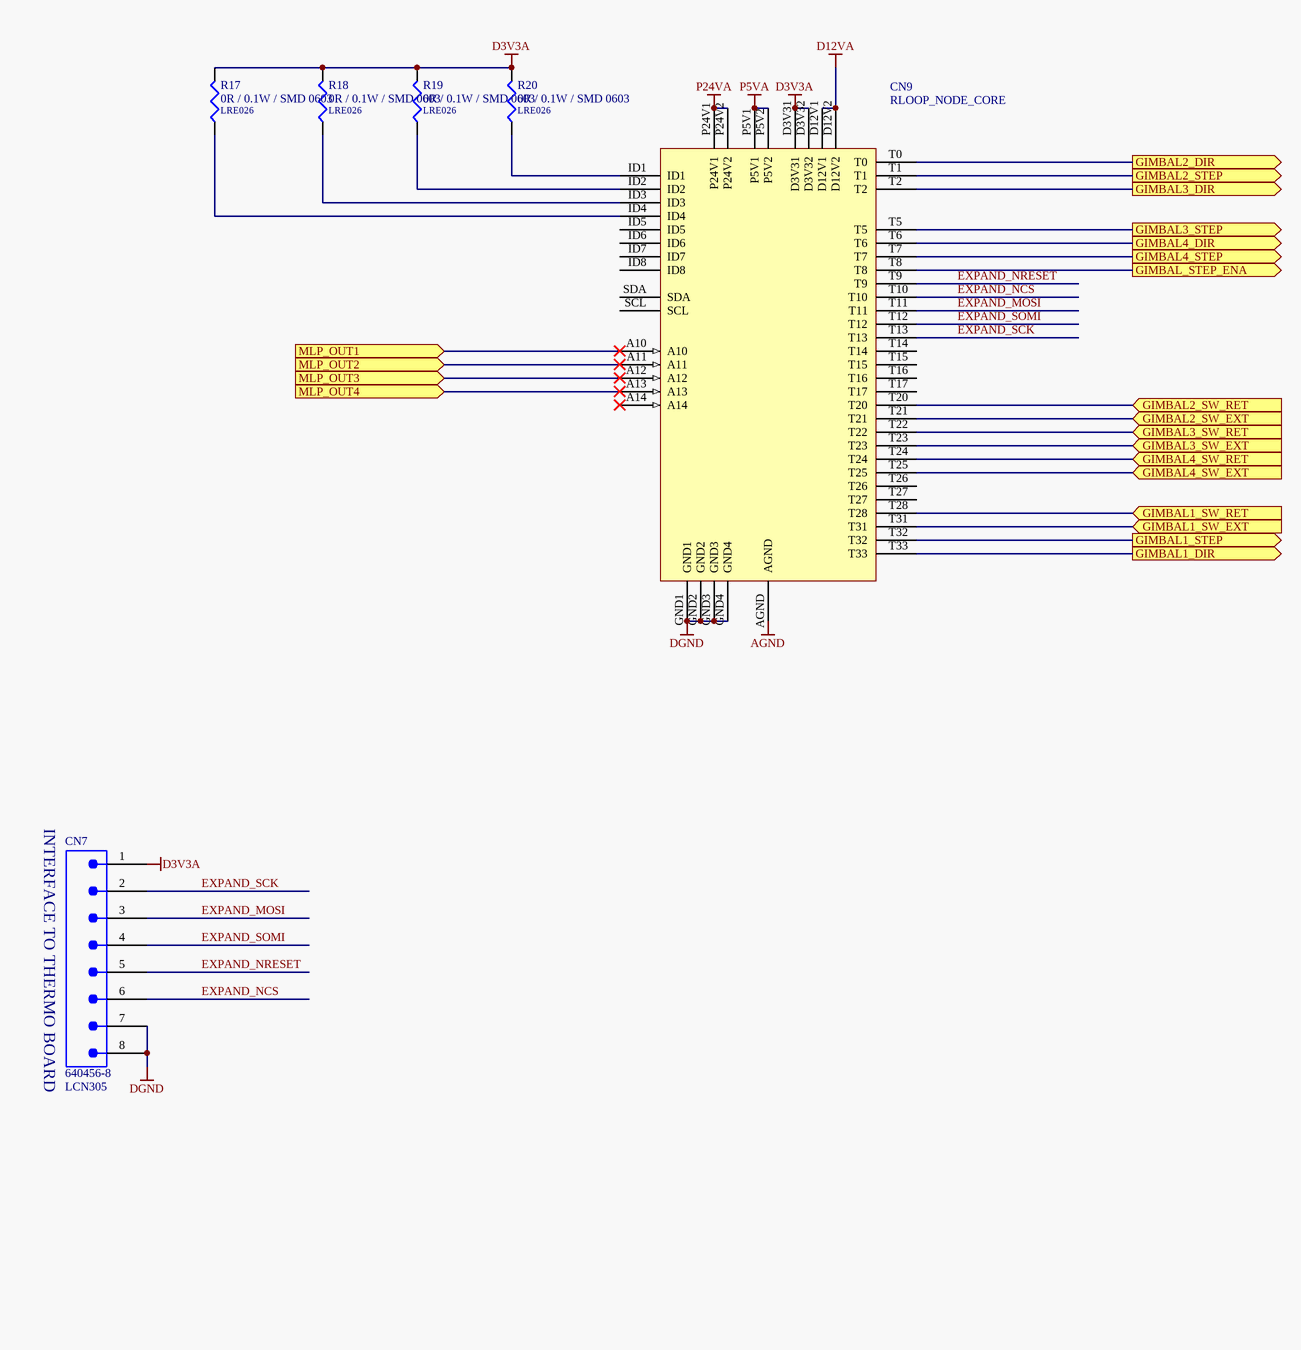
[diagram p5: LPCB221 - CORE INTERFACE.SchDoc]

### Parts
CN7  640456-8  LDL_NUMBER: LCN305  [640456-8]
CN9  RLOOP_NODE_CORE  [RLOOP_NODE_CORE]  (no BOM)
R17  0R / 0.1W / SMD 0603  LDL_NUMBER: LRE026  [LFP020__CR1608-0603-IPC7351_B]
R18  0R / 0.1W / SMD 0603  LDL_NUMBER: LRE026  [LFP020__CR1608-0603-IPC7351_B]
R19  0R / 0.1W / SMD 0603  LDL_NUMBER: LRE026  [LFP020__CR1608-0603-IPC7351_B]
R20  0R / 0.1W / SMD 0603  LDL_NUMBER: LRE026  [LFP020__CR1608-0603-IPC7351_B]

### Ports
GIMBAL1_DIR (out), GIMBAL1_STEP (out), GIMBAL1_SW_EXT (in), GIMBAL1_SW_RET (in), GIMBAL2_DIR (out), GIMBAL2_STEP (out), GIMBAL2_SW_EXT (in), GIMBAL2_SW_RET (in), GIMBAL3_DIR (out), GIMBAL3_STEP (out), GIMBAL3_SW_EXT (in), GIMBAL3_SW_RET (in), GIMBAL4_DIR (out), GIMBAL4_STEP (out), GIMBAL4_SW_EXT (in), GIMBAL4_SW_RET (in), GIMBAL_STEP_ENA (out), MLP_OUT1 (in), MLP_OUT2 (in), MLP_OUT3 (in), MLP_OUT4 (in)

### Nets
AGND: CN9.AGND
D3V3A: CN7.1 CN9.D3V31 CN9.D3V32 R17.2 R18.2 R19.2 R20.2
D12VA: CN9.D12V1 CN9.D12V2
DGND: CN7.7 CN7.8 CN9.GND1 CN9.GND2 CN9.GND3 CN9.GND4
P5VA: CN9.P5V1 CN9.P5V2
P24VA: CN9.P24V1 CN9.P24V2
EXPAND_MOSI: CN7.3 CN9.T11
EXPAND_NCS: CN7.6 CN9.T10
EXPAND_NRESET: CN7.5 CN9.T9
EXPAND_SCK: CN7.2 CN9.T13
EXPAND_SOMI: CN7.4 CN9.T12
GIMBAL1_DIR: CN9.T33 ; port GIMBAL1_DIR
GIMBAL1_STEP: CN9.T32 ; port GIMBAL1_STEP
GIMBAL1_SW_EXT: CN9.T31 ; port GIMBAL1_SW_EXT
GIMBAL1_SW_RET: CN9.T28 ; port GIMBAL1_SW_RET
GIMBAL2_DIR: CN9.T0 ; port GIMBAL2_DIR
GIMBAL2_STEP: CN9.T1 ; port GIMBAL2_STEP
GIMBAL2_SW_EXT: CN9.T21 ; port GIMBAL2_SW_EXT
GIMBAL2_SW_RET: CN9.T20 ; port GIMBAL2_SW_RET
GIMBAL3_DIR: CN9.T2 ; port GIMBAL3_DIR
GIMBAL3_STEP: CN9.T5 ; port GIMBAL3_STEP
GIMBAL3_SW_EXT: CN9.T23 ; port GIMBAL3_SW_EXT
GIMBAL3_SW_RET: CN9.T22 ; port GIMBAL3_SW_RET
GIMBAL4_DIR: CN9.T6 ; port GIMBAL4_DIR
GIMBAL4_STEP: CN9.T7 ; port GIMBAL4_STEP
GIMBAL4_SW_EXT: CN9.T25 ; port GIMBAL4_SW_EXT
GIMBAL4_SW_RET: CN9.T24 ; port GIMBAL4_SW_RET
GIMBAL_STEP_ENA: CN9.T8 ; port GIMBAL_STEP_ENA
MLP_OUT1: CN9.A10 ; port MLP_OUT1
MLP_OUT2: CN9.A11 ; port MLP_OUT2
MLP_OUT3: CN9.A12 ; port MLP_OUT3
MLP_OUT4: CN9.A13 ; port MLP_OUT4
NetCN9_ID1: CN9.ID1 R20.1
NetCN9_ID2: CN9.ID2 R19.1
NetCN9_ID3: CN9.ID3 R18.1
NetCN9_ID4: CN9.ID4 R17.1

Not connected (* = marked no-connect by the designer): CN9 A14* ID5 ID6 ID7 ID8 SCL SDA T14 T15 T16 T17 T26 T27

### Notes on the sheet
- (near CN7) INTERFACE TO THERMO BOARD
- PCB COMPONENT DESCRIPTION
- LDL NUMBER
- Assembly Details
- Size
- Drawing File Name
- Revision
- http://rloop.org
- Scale
- A3
- Sheet Details
- N.T.S
- Sheet:
- Of:

### Library data of the parts
CN7 = 640456-8: as CN1 on sheet LPCB221 - G210X INTERFACE; FMEDA__FUNCTION_IN_SYSTEM: *; FMEDA__OPERATING__CURRENT_MIN: 0; FMEDA__OPERATING__CURRENT_TYP: 0; FMEDA__OPERATING__VOLTAGE_MIN: 0
CN9 = RLOOP_NODE_CORE: rLoop Node Core Connector; FMEDA__CHANNEL: COM; FMEDA__OPERATING__CURRENT_MAX: 0; FMEDA__OPERATING__TEMP_MAX: 50; FMEDA__OPERATING__TEMP_MIN: -20; FMEDA__OPERATING__TEMP_TYP: 27; FMEDA__OPERATING__VOLTAGE_MAX: 16; FMEDA__OPERATING__VOLTAGE_TYP: 12; FMEDA__OPERATING__CURRENT_MIN: 0; FMEDA__OPERATING__CURRENT_TYP: 0; FMEDA__OPERATING__VOLTAGE_MIN: 0
R17-R20 = 0R / 0.1W / SMD 0603: Resistor, Ceramic Chip, 0R, 0.1W, SMD 0603 [LRE026]; Value: 0; FMEDA__OPERATING__TEMP_MAX: 50; FMEDA__OPERATING__TEMP_MIN: -20; FMEDA__OPERATING__TEMP_TYP: 27; FMEDA__CHANNEL: COM; FMEDA__OPERATING__POWER_MAX: 0; FMEDA__OPERATING__POWER_MIN: 0; FMEDA__OPERATING__VOLTAGE_MAX: 0; FMEDA__OPERATING__VOLTAGE_MIN: 0; FMEDA__OPERATING__VOLTAGE_TYP: 0; FMEDA__FUNCTION_IN_SYSTEM: *

## Nets that join several sheets
AGND: LPCB221 - MLP (8 pins), U_LPCB221 - MLP/M1 (9 pins), U_LPCB221 - MLP/M2 (9 pins), U_LPCB221 - MLP/M3 (9 pins), U_LPCB221 - MLP/M4 (9 pins), LPCB221 - CORE INTERFACE (CN9.AGND)
D3V3A: LPCB221 - LIMIT SWITCHES (8 pins), LPCB221 - CORE INTERFACE (7 pins)
DGND: LPCB221 - G210X INTERFACE (18 pins), LPCB221 - LIMIT SWITCHES (20 pins), LPCB221 - CORE INTERFACE (6 pins)
P5VA: LPCB221 - G210X INTERFACE (8 pins), LPCB221 - CORE INTERFACE (CN9.P5V1 CN9.P5V2)
P24VA: LPCB221 - MLP (D1.1 D2.1 D3.1 D4.1), U_LPCB221 - MLP/M1 (C22_M1.1 C23_M1.1 IC11_M1.16), U_LPCB221 - MLP/M2 (C22_M2.1 C23_M2.1 IC11_M2.16), U_LPCB221 - MLP/M3 (C22_M3.1 C23_M3.1 IC11_M3.16), U_LPCB221 - MLP/M4 (C22_M4.1 C23_M4.1 IC11_M4.16), LPCB221 - LIMIT SWITCHES (CN3.1 CN3.5 CN4.1 CN4.5), LPCB221 - CORE INTERFACE (CN9.P24V1 CN9.P24V2)
GIMBAL1_DIR: LPCB221 - G210X INTERFACE (IC1.3 TP2.1), LPCB221 - CORE INTERFACE (CN9.T33)
GIMBAL1_STEP: LPCB221 - G210X INTERFACE (IC1.6 TP5.1), LPCB221 - CORE INTERFACE (CN9.T32)
GIMBAL1_SW_EXT: LPCB221 - LIMIT SWITCHES (IC3.9), LPCB221 - CORE INTERFACE (CN9.T31)
GIMBAL1_SW_RET: LPCB221 - LIMIT SWITCHES (IC3.12), LPCB221 - CORE INTERFACE (CN9.T28)
GIMBAL2_DIR: LPCB221 - G210X INTERFACE (IC1.10 TP4.1), LPCB221 - CORE INTERFACE (CN9.T0)
GIMBAL2_STEP: LPCB221 - G210X INTERFACE (IC1.13 TP3.1), LPCB221 - CORE INTERFACE (CN9.T1)
GIMBAL2_SW_EXT: LPCB221 - LIMIT SWITCHES (IC5.9), LPCB221 - CORE INTERFACE (CN9.T21)
GIMBAL2_SW_RET: LPCB221 - LIMIT SWITCHES (IC5.12), LPCB221 - CORE INTERFACE (CN9.T20)
GIMBAL3_DIR: LPCB221 - G210X INTERFACE (IC2.3 TP6.1), LPCB221 - CORE INTERFACE (CN9.T2)
GIMBAL3_STEP: LPCB221 - G210X INTERFACE (IC2.6 TP7.1), LPCB221 - CORE INTERFACE (CN9.T5)
GIMBAL3_SW_EXT: LPCB221 - LIMIT SWITCHES (IC4.9), LPCB221 - CORE INTERFACE (CN9.T23)
GIMBAL3_SW_RET: LPCB221 - LIMIT SWITCHES (IC4.12), LPCB221 - CORE INTERFACE (CN9.T22)
GIMBAL4_DIR: LPCB221 - G210X INTERFACE (IC2.10 TP9.1), LPCB221 - CORE INTERFACE (CN9.T6)
GIMBAL4_STEP: LPCB221 - G210X INTERFACE (IC2.13 TP8.1), LPCB221 - CORE INTERFACE (CN9.T7)
GIMBAL4_SW_EXT: LPCB221 - LIMIT SWITCHES (IC6.9), LPCB221 - CORE INTERFACE (CN9.T25)
GIMBAL4_SW_RET: LPCB221 - LIMIT SWITCHES (IC6.12), LPCB221 - CORE INTERFACE (CN9.T24)
GIMBAL_STEP_ENA: LPCB221 - G210X INTERFACE (IC1.1 IC2.1 TP1.1), LPCB221 - CORE INTERFACE (CN9.T8)
MA420IN1: LPCB221 - MLP (CN5.2), U_LPCB221 - MLP/M1 (IC11_M1.3)
MA420IN2: LPCB221 - MLP (CN5.4), U_LPCB221 - MLP/M2 (IC11_M2.3)
MA420IN3: LPCB221 - MLP (CN6.2), U_LPCB221 - MLP/M3 (IC11_M3.3)
MA420IN4: LPCB221 - MLP (CN6.4), U_LPCB221 - MLP/M4 (IC11_M4.3)
MLP_OUT1: U_LPCB221 - MLP/M1 (5 pins), LPCB221 - CORE INTERFACE (CN9.A10)
MLP_OUT2: U_LPCB221 - MLP/M2 (5 pins), LPCB221 - CORE INTERFACE (CN9.A11)
MLP_OUT3: U_LPCB221 - MLP/M3 (5 pins), LPCB221 - CORE INTERFACE (CN9.A12)
MLP_OUT4: U_LPCB221 - MLP/M4 (5 pins), LPCB221 - CORE INTERFACE (CN9.A13)